# EasyEDA schematic 1-Schematic_STATIC FIRE MONITOR R0.json
TITLE: Motor_Test_Monitor_Schematic; REV: 1.0; Date: 2025-10-23; Sheet: 1/1; Drawn By: gvsravan007; Company: VelR
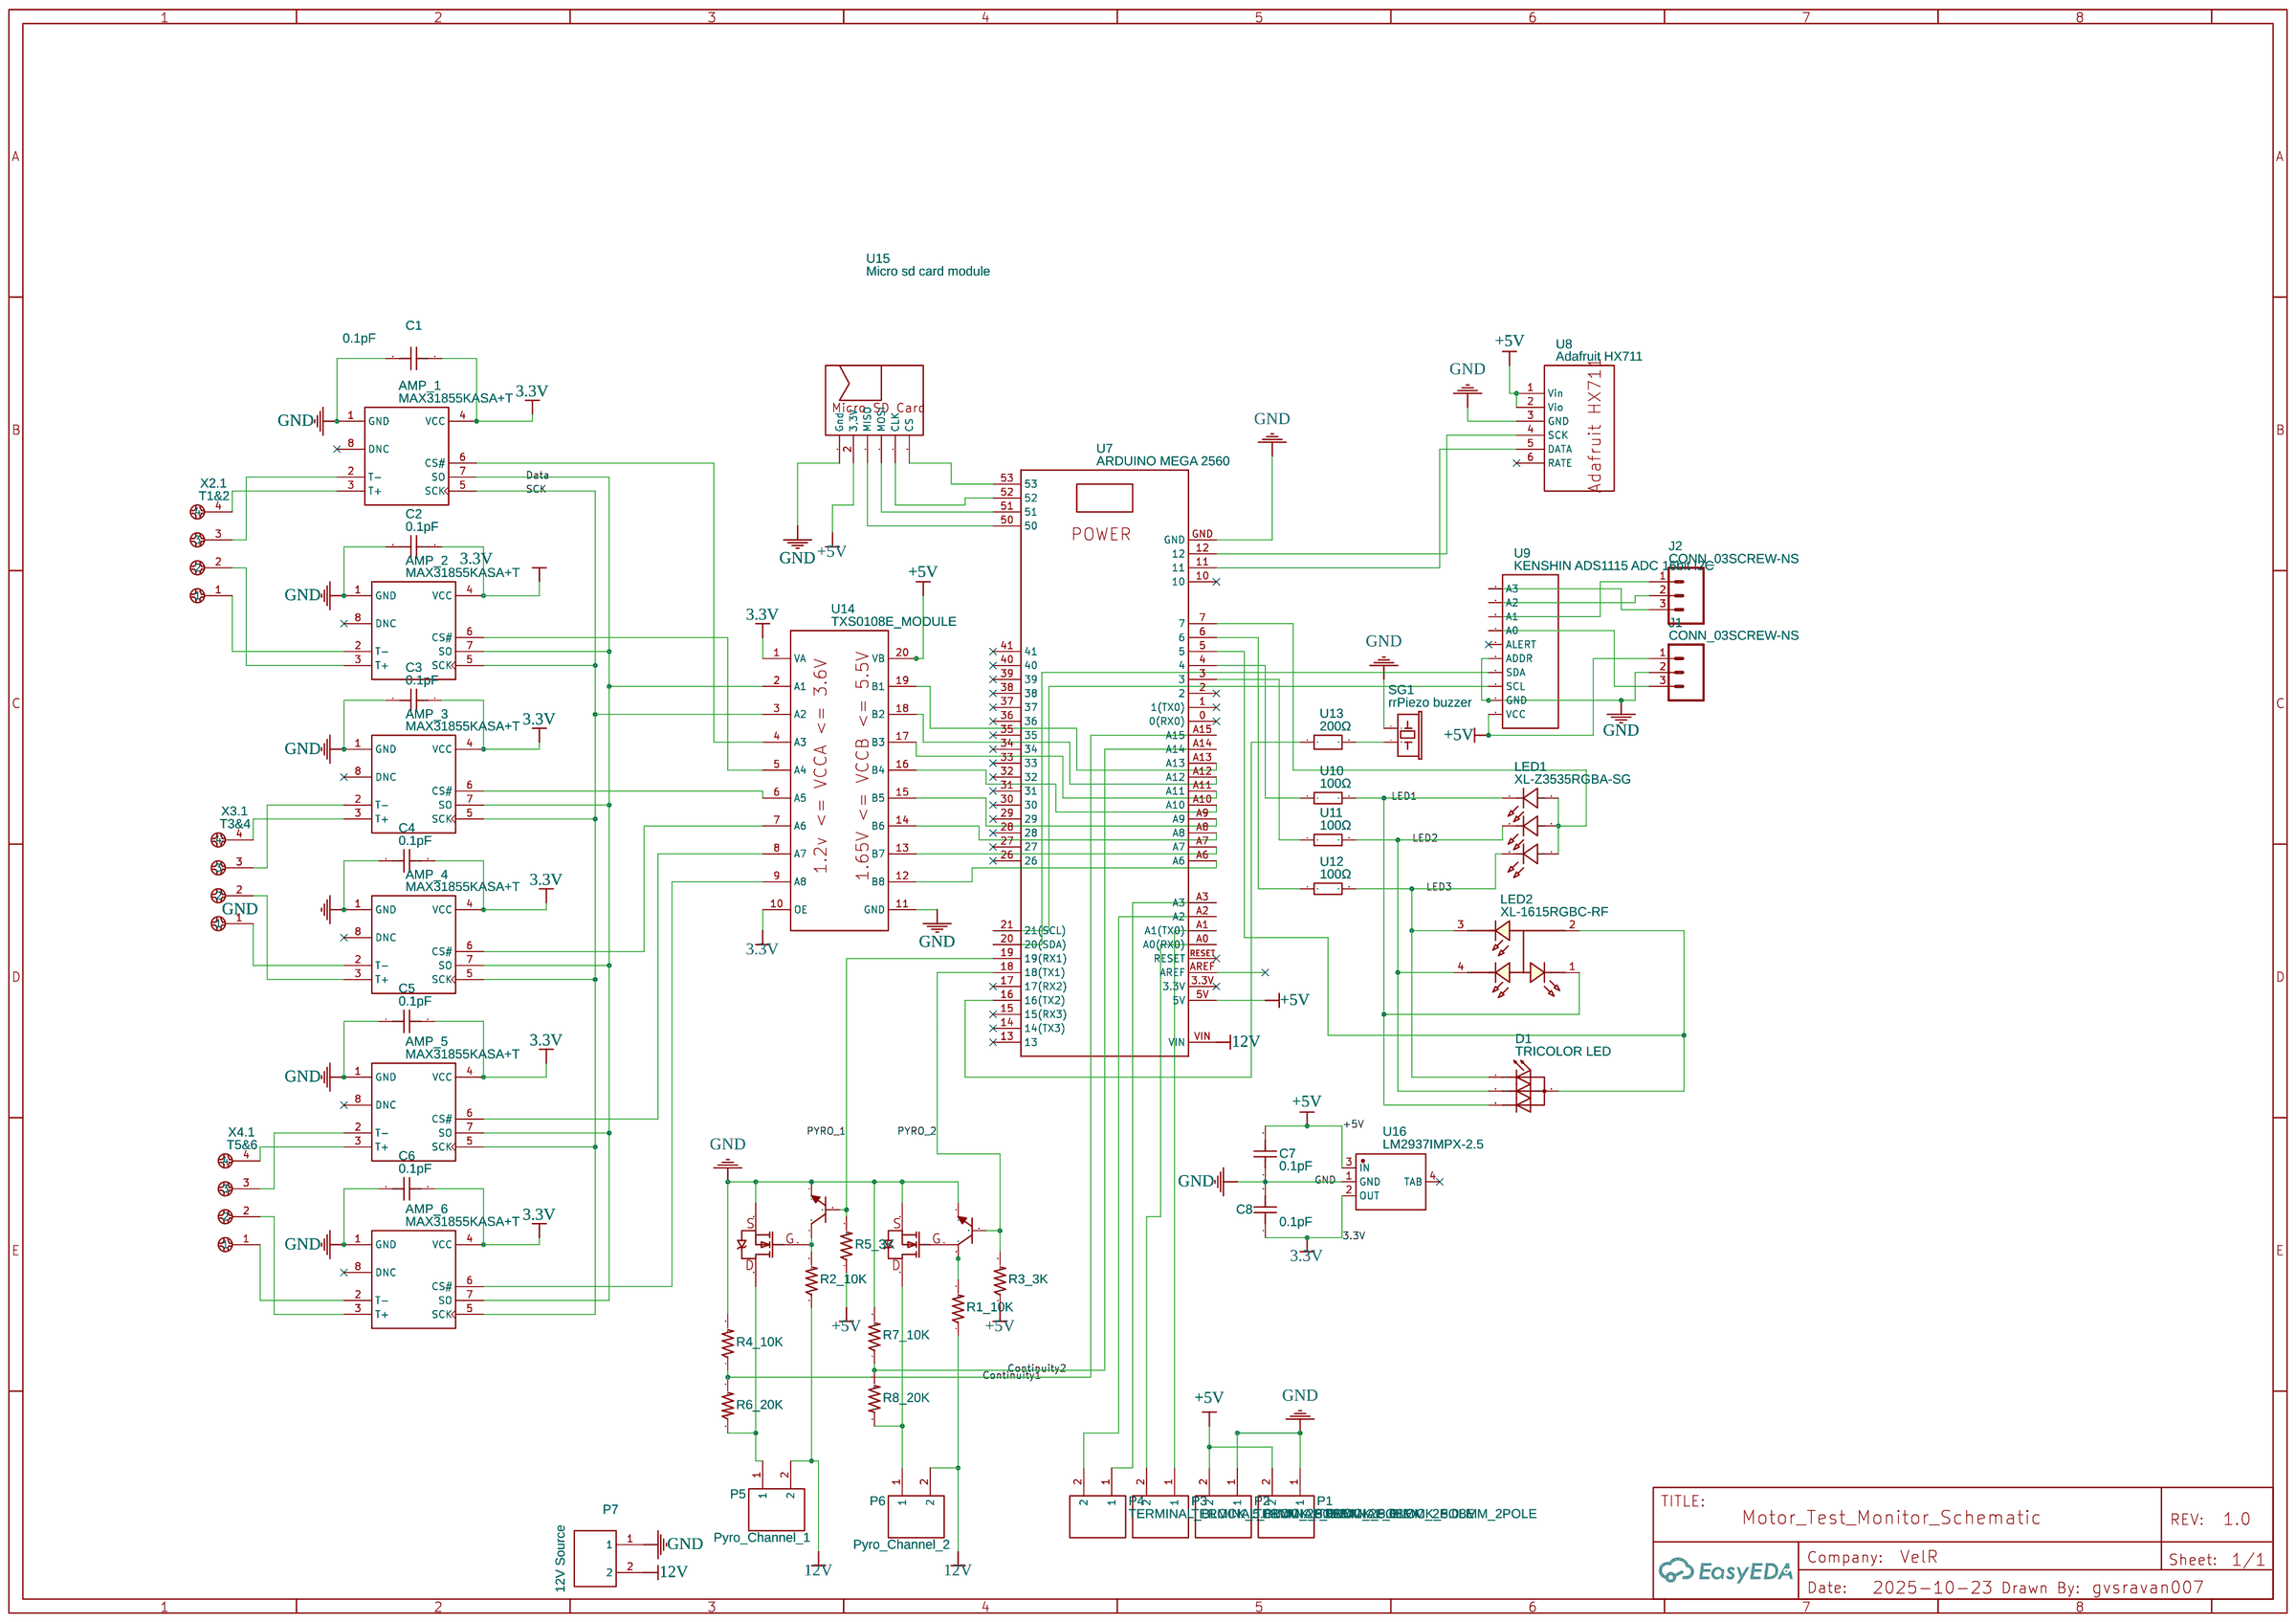
[diagram p0: schematic sheet]

## Parts
AMP_1  MAX31855KASA+T  [SO-8_L4.9-W3.9-P1.27-LS5.9-BL]
AMP_2  MAX31855KASA+T  [SO-8_L4.9-W3.9-P1.27-LS5.9-BL]
AMP_3  MAX31855KASA+T  [SO-8_L4.9-W3.9-P1.27-LS5.9-BL]
AMP_4  MAX31855KASA+T  [SO-8_L4.9-W3.9-P1.27-LS5.9-BL]
AMP_5  MAX31855KASA+T  [SO-8_L4.9-W3.9-P1.27-LS5.9-BL]
AMP_6  MAX31855KASA+T  [SO-8_L4.9-W3.9-P1.27-LS5.9-BL]
C1  0.1pF  [C0603]
C2  0.1pF  [C0603]
C3  0.1pF  [C0603]
C4  0.1pF  [C0603]
C5  0.1pF  [C0603]
C6  0.1pF  [C0603]
C7  0.1pF  [C0603]
C8  0.1pF  [C0603]
CONTINUITY2  IRL 540N  [IRF540NTO-220AB-P3P81]
D1  TRICOLOR LED  [LED-TRICOLOR-THROUGHHOLE]
GND  IRL 540N  [IRF540NTO-220AB-P3P81]
J1  CONN_03SCREW-NS  [SCREWTERMINAL-3.5MM-3-NS]
J2  CONN_03SCREW-NS  [SCREWTERMINAL-3.5MM-3-NS]
LED1  XL-Z3535RGBA-SG  [LED-SMD_6P-L3.7W3.5-P1.10-BR]
LED2  XL-1615RGBC-RF  [LED-ARRAY-SMD_4P-L1.6-W1.5-BR_XL-1615RGBC-RF]
P1  TERMINAL_BLOCK_5.08MM_2POLE  [TERMINALBLOCK_PHEONIX_PT-5.08MM_2POL]
P2  TERMINAL_BLOCK_5.08MM_2POLE  [TERMINALBLOCK_PHEONIX_PT-5.08MM_2POL]
P3  TERMINAL_BLOCK_5.08MM_2POLE  [TERMINALBLOCK_PHEONIX_PT-5.08MM_2POL]
P4  TERMINAL_BLOCK_5.08MM_2POLE  [TERMINALBLOCK_PHEONIX_PT-5.08MM_2POL]
P5  Pyro_Channel_1  [TERMINALBLOCK_PHEONIX_PT-5.08MM_2POL]
P6  Pyro_Channel_2  [TERMINALBLOCK_PHEONIX_PT-5.08MM_2POL]
P7  12V Source  [TERMINALBLOCK_PHEONIX_PT-5.08MM_2POL]
Q1  2N2222  [BJT FOOTPRINT _3D_MODEL]
Q2  2N2222  [BJT FOOTPRINT _3D_MODEL]
R1_10K  RESISTORS_R_1W  [RES-TH_BD2.4-L6.3-P10.30-D0.6]
R2_10K  RESISTORS_R_1W  [RES-TH_BD2.4-L6.3-P10.30-D0.6]
R3_3K  3k  [RES-TH_BD2.4-L6.3-P10.30-D0.6]
R4_10K  RESISTORS_R_1W  [RES-TH_BD2.4-L6.3-P10.30-D0.6]
R5_3K  RESISTORS_R_1W  [RES-TH_BD2.4-L6.3-P10.30-D0.6]
R6_20K  RESISTORS_R_1W  [RES-TH_BD2.4-L6.3-P10.30-D0.6]
R7_10K  RESISTORS_R_1W  [RES-TH_BD2.4-L6.3-P10.30-D0.6]
R8_20K  RESISTORS_R_1W  [RES-TH_BD2.4-L6.3-P10.30-D0.6]
SG1  rrPiezo buzzer  [BUZZER-12MM-NS-KIT]
U7  ARDUINO MEGA 2560  [ARDUINO_MEGA-PRO-3.3V COPY]
U8  Adafruit HX711  [ADAFRUIT HX711]
U9  KENSHIN ADS1115 ADC 16bit I2C  [ADS115_MODUL]
U10  100Ω  [RES-TH_BD2.4-L6.3-P10.30-D0.6]
U11  100Ω  [RES-TH_BD2.4-L6.3-P10.30-D0.6]
U12  100Ω  [RES-TH_BD2.4-L6.3-P10.30-D0.6]
U13  200Ω  [RES-TH_BD2.4-L6.3-P10.30-D0.6]
U14  TXS0108E_MODULE  [TXS0108E_DRIVER_BREAKOUT_BOARD]
U15  Micro sd card module  [MICRO SD CARD MODULE W/ SD CARD]
U16  LM2937IMPX-2.5  [SOT-223-4_L6.5-W3.5-P2.30-LS7.0-BR]
X2  T1&2  [BARRIER_TERMINAL_7.5MM 4PIN]  (section 1)
X3  T3&4  [BARRIER_TERMINAL_7.5MM 4PIN]  (section 1)
X4  T5&6  [BARRIER_TERMINAL_7.5MM 4PIN]  (section 1)

## Library data of the parts
AMP_1-AMP_6 = MAX31855KASA+T: Supplier: LCSC; Manufacturer: ADI(亚德诺)/MAXIM(美信); Supplier Part: C52028; JLCPCB Part Class: Extended Part
C1-C8 = VJ0603D0R1VXPAJ: Contributor: LCSC; Supplier: LCSC; Supplier Part: C2181339; Manufacturer: VISHAY(威世); JLCPCB Part Class: Extended Part
CONTINUITY2 GND = IRF540N: HEXFET Power MOSFET; Contributor: oliwia
D1 = TRICOLOR LED: Contributor: KiCad
J1 J2 = CONN_03SCREW-NS: Contributor: capautv
LED1 = XL-Z3535RGBA-SG: Supplier: LCSC; Supplier Part: C22461787; Manufacturer: XINGLIGHT(成兴光); JLCPCB Part Class: Extended Part; Contributor: lcsc
LED2 = XL-1615RGBC-RF: Contributor: LCSC; Supplier: LCSC; Supplier Part: C965840; Manufacturer: XINGLIGHT(成兴光); JLCPCB Part Class: Extended Part
P1-P7 = TERMINAL_BLOCK_5.08MM_2POLE: Supplier Part: C8426; Supplier: LCSC; Manufacturer: ReliaPro; Contributor: RaspAutomacao
Q1 Q2 = 2N2222: Supplier: LCSC; Supplier Part: C358533; Manufacturer: Foshan Blue Rocket Elec; Manufacturer Part: 2N2222A; Contributor: LCSC; JLCPCB Part Class: Extended Part
R1_10K R2_10K R3_3K R4_10K R5_3K R6_20K R7_10K R8_20K = RESISTORS_R_1W: Contributor: Sevin7
SG1 = rrPiezo buzzer: Buzzer 12mm; Contributor: richard_at_nait
U7 = ARDUINO MEGA 2560: Contributor: gvsravan007; sourceId: DrlDxP6oG
U8 = Adafruit HX711: Contributor: gvsravan007
U9 = KENSHIN ADS1115 ADC 16bit I2C: Contributor: Mikimoto Aguillo
U10-U12 = YAGEO 100 OHM: Contributor: lcsc; Supplier: LCSC; Supplier Part: C1378349; Manufacturer: YAGEO(国巨); Manufacturer Part: RSF50SJT-PN100R
U13 = WHC200FET: Contributor: lcsc; Supplier: LCSC; Supplier Part: C3438475; Manufacturer: Ohmite; JLCPCB Part Class: Extended Part
U14 = TXS0108E_MODULE: Manufacturer Part: TXS0108E_BREAKOUT_BOARD; Contributor: kczarnom
U15 = Micro sd card module: Contributor: anisfligha
U16 = LM2937IMPX-2.5: Contributor: lcsc; Supplier: LCSC; Supplier Part: C3749724; Manufacturer: TI(德州仪器)
X2-X4 = Terminal_7.5mm 4PIN: Barrier Blocks Sreies 5202; Contributor: artit.p

## Nets
3.3V: AMP_1.4(VCC) AMP_2.4(VCC) AMP_3.4(VCC) AMP_4.4(VCC) AMP_5.4(VCC) AMP_6.4(VCC) C1.2 C2.2 C3.2 C4.2 C5.2 C6.2 C8.1 U14.1(VA) U14.10(OE) U16.2(OUT)
12V: P5.2 P6.2 P7.2 R1_10K.1 R2_10K.1 U7.VIN
+5V: C7.2 J1.1 P1.2 P2.2 R3_3K.1 R5_3K.1 U7.5V U8.1(Vin) U8.2(Vio) U9.1(VCC) U14.20(VB) U15.2(3,3V) U16.3(IN)
GND: AMP_1.1(GND) AMP_2.1(GND) AMP_3.1(GND) AMP_4.1(GND) AMP_5.1(GND) AMP_6.1(GND) C1.1 C2.1 C3.1 C4.1 C5.1 C6.1 C7.1 C8.2 CONTINUITY2.3(S) GND.3(S) J1.2 P1.1 P2.1 P7.1 Q1.1(E) Q2.1(E) R4_10K.2 R7_10K.2 SG1.+(1) U7.GND U8.3(GND) U9.2(GND) U9.5(ADDR) U14.11(GND) U15.1(Gnd) U16.1(GND)
Continuity1: R4_10K.1 R6_20K.2 U7.A15
Continuity2: R7_10K.1 R8_20K.2 U7.A14
Data: AMP_1.7(SO) AMP_2.7(SO) AMP_3.7(SO) AMP_4.7(SO) AMP_5.7(SO) AMP_6.7(SO) U14.2(A1)
LED1: D1.BLU(4) LED1.1(-) LED2.1(R-) U10.2
LED2: D1.GRN(3) LED1.2(-) LED2.4(G-) U11.2
LED3: D1.RED(2) LED1.3(-) LED2.3(B-) U12.2
PYRO_1: Q1.2(B) R5_3K.2 U7.19(19(RX1))
PYRO_2: Q2.2(B) R3_3K.2 U7.18(18(TX1))
SCK: AMP_1.5(SCK) AMP_2.5(SCK) AMP_3.5(SCK) AMP_4.5(SCK) AMP_5.5(SCK) AMP_6.5(SCK) U14.3(A2)
Net-(AMP_1-2): AMP_1.2(T-) X2.3
Net-(AMP_1-3): AMP_1.3(T+) X2.4
Net-(AMP_1-6): AMP_1.6(CS#) U14.4(A3)
Net-(AMP_2-2): AMP_2.2(T-) X2.1
Net-(AMP_2-3): AMP_2.3(T+) X2.2
Net-(AMP_2-6): AMP_2.6(CS#) U14.5(A4)
Net-(AMP_3-2): AMP_3.2(T-) X3.3
Net-(AMP_3-3): AMP_3.3(T+) X3.4
Net-(AMP_3-6): AMP_3.6(CS#) U14.6(A5)
Net-(AMP_4-2): AMP_4.2(T-) X3.1
Net-(AMP_4-3): AMP_4.3(T+) X3.2
Net-(AMP_4-6): AMP_4.6(CS#) U14.7(A6)
Net-(AMP_5-2): AMP_5.2(T-) X4.3
Net-(AMP_5-3): AMP_5.3(T+) X4.4
Net-(AMP_5-6): AMP_5.6(CS#) U14.8(A7)
Net-(AMP_6-2): AMP_6.2(T-) X4.1
Net-(AMP_6-3): AMP_6.3(T+) X4.2
Net-(AMP_6-6): AMP_6.6(CS#) U14.9(A8)
Net-(CONTINUITY2-1): CONTINUITY2.1(G) Q2.3(C) R1_10K.2
Net-(CONTINUITY2-2): CONTINUITY2.2(D) P6.1 R8_20K.1
Net-(D1-GND): D1.GND(1) LED2.2(COM+) U7.5
Net-(GND-1): GND.1(G) Q1.3(C) R2_10K.2
Net-(GND-2): GND.2(D) P5.1 R6_20K.1
Net-(J1-3): J1.3 U9.7(A0)
Net-(J2-1): J2.1 U9.8(A1)
Net-(J2-2): J2.2 U9.9(A2)
Net-(J2-3): J2.3 U9.10(A3)
Net-(LED1-4): LED1.4(+) LED1.5(+) LED1.6(+) U7.7
Net-(P3-1): P3.1 U7.A1(A1(TX0))
Net-(P3-2): P3.2 U7.A0(A0(RX0))
Net-(P4-1): P4.1 U7.A3
Net-(P4-2): P4.2 U7.A2
Net-(SG1--): SG1.-(2) U13.2
Net-(U7-3): U7.3 U11.1
Net-(U7-4): U7.4 U10.1
Net-(U7-6): U7.6 U12.1
Net-(U7-11): U7.11 U8.5(DATA)
Net-(U7-12): U7.12 U8.4(SCK)
Net-(U7-16): U7.16(16(TX2)) U13.1
Net-(U7-20): U7.20(20(SDA)) U9.4(SDA)
Net-(U7-21): U7.21(21(SCL)) U9.3(SCL)
Net-(U7-50): U7.50 U15.3(MISO)
Net-(U7-51): U7.51 U15.4(MOSI)
Net-(U7-52): U7.52 U15.5(CLK)
Net-(U7-53): U7.53 U15.6(CS)
Net-(U7-A6): U7.A6 U14.12(B8)
Net-(U7-A7): U7.A7 U14.13(B7)
Net-(U7-A8): U7.A8 U14.14(B6)
Net-(U7-A9): U7.A9 U14.15(B5)
Net-(U7-A10): U7.A10 U14.16(B4)
Net-(U7-A11): U7.A11 U14.17(B3)
Net-(U7-A12): U7.A12 U14.18(B2)
Net-(U7-A13): U7.A13 U14.19(B1)

Not connected (* = marked no-connect by the designer): AMP_1 8(DNC)*; AMP_2 8(DNC)*; AMP_3 8(DNC)*; AMP_4 8(DNC)*; AMP_5 8(DNC)*; AMP_6 8(DNC)*; U7 0(0(RX0))* 1(1(TX0))* 2* 3.3V* 10* 13* 14(14(TX3))* 15(15(RX3))* 17(17(RX2))* 26* 27* 28* 29* 30* 31* 32* 33* 34* 35* 36* 37* 38* 39* 40* 41* AREF RESET*; U8 6(RATE)*; U9 6(ALERT)*; U16 4(TAB)*
